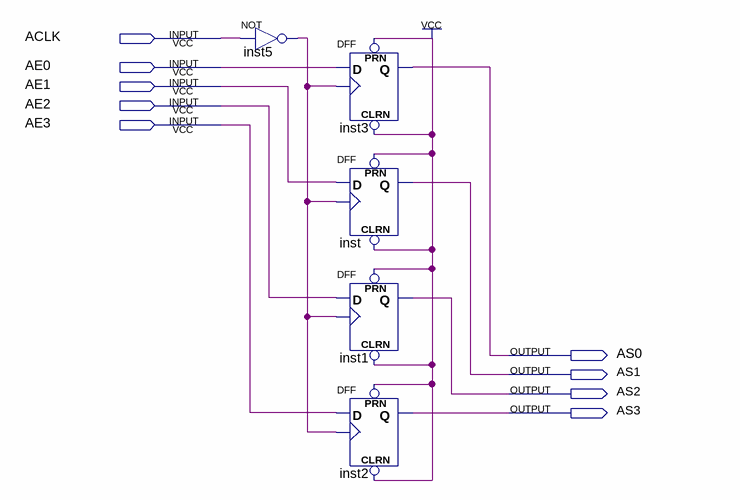
[diagram p0: schematic sheet]
// Quartus schematic atraso.bdf as structural Verilog: 5 symbols, 9 pins
module atraso (
  input  ACLK,
  input  AE0,
  input  AE1,
  input  AE2,
  input  AE3,
  output AS0,
  output AS1,
  output AS2,
  output AS3
);

  wire inst5_out;

  not inst5 (inst5_out, ACLK);
  DFF inst3 (.CLRN(1'b1), .CLK(inst5_out), .D(AE0), .PRN(1'b1), .Q(AS0));
  DFF inst (.CLRN(1'b1), .CLK(inst5_out), .D(AE1), .PRN(1'b1), .Q(AS1));
  DFF inst1 (.CLRN(1'b1), .CLK(inst5_out), .D(AE2), .PRN(1'b1), .Q(AS2));
  DFF inst2 (.CLRN(1'b1), .CLK(inst5_out), .D(AE3), .PRN(1'b1), .Q(AS3));
endmodule
